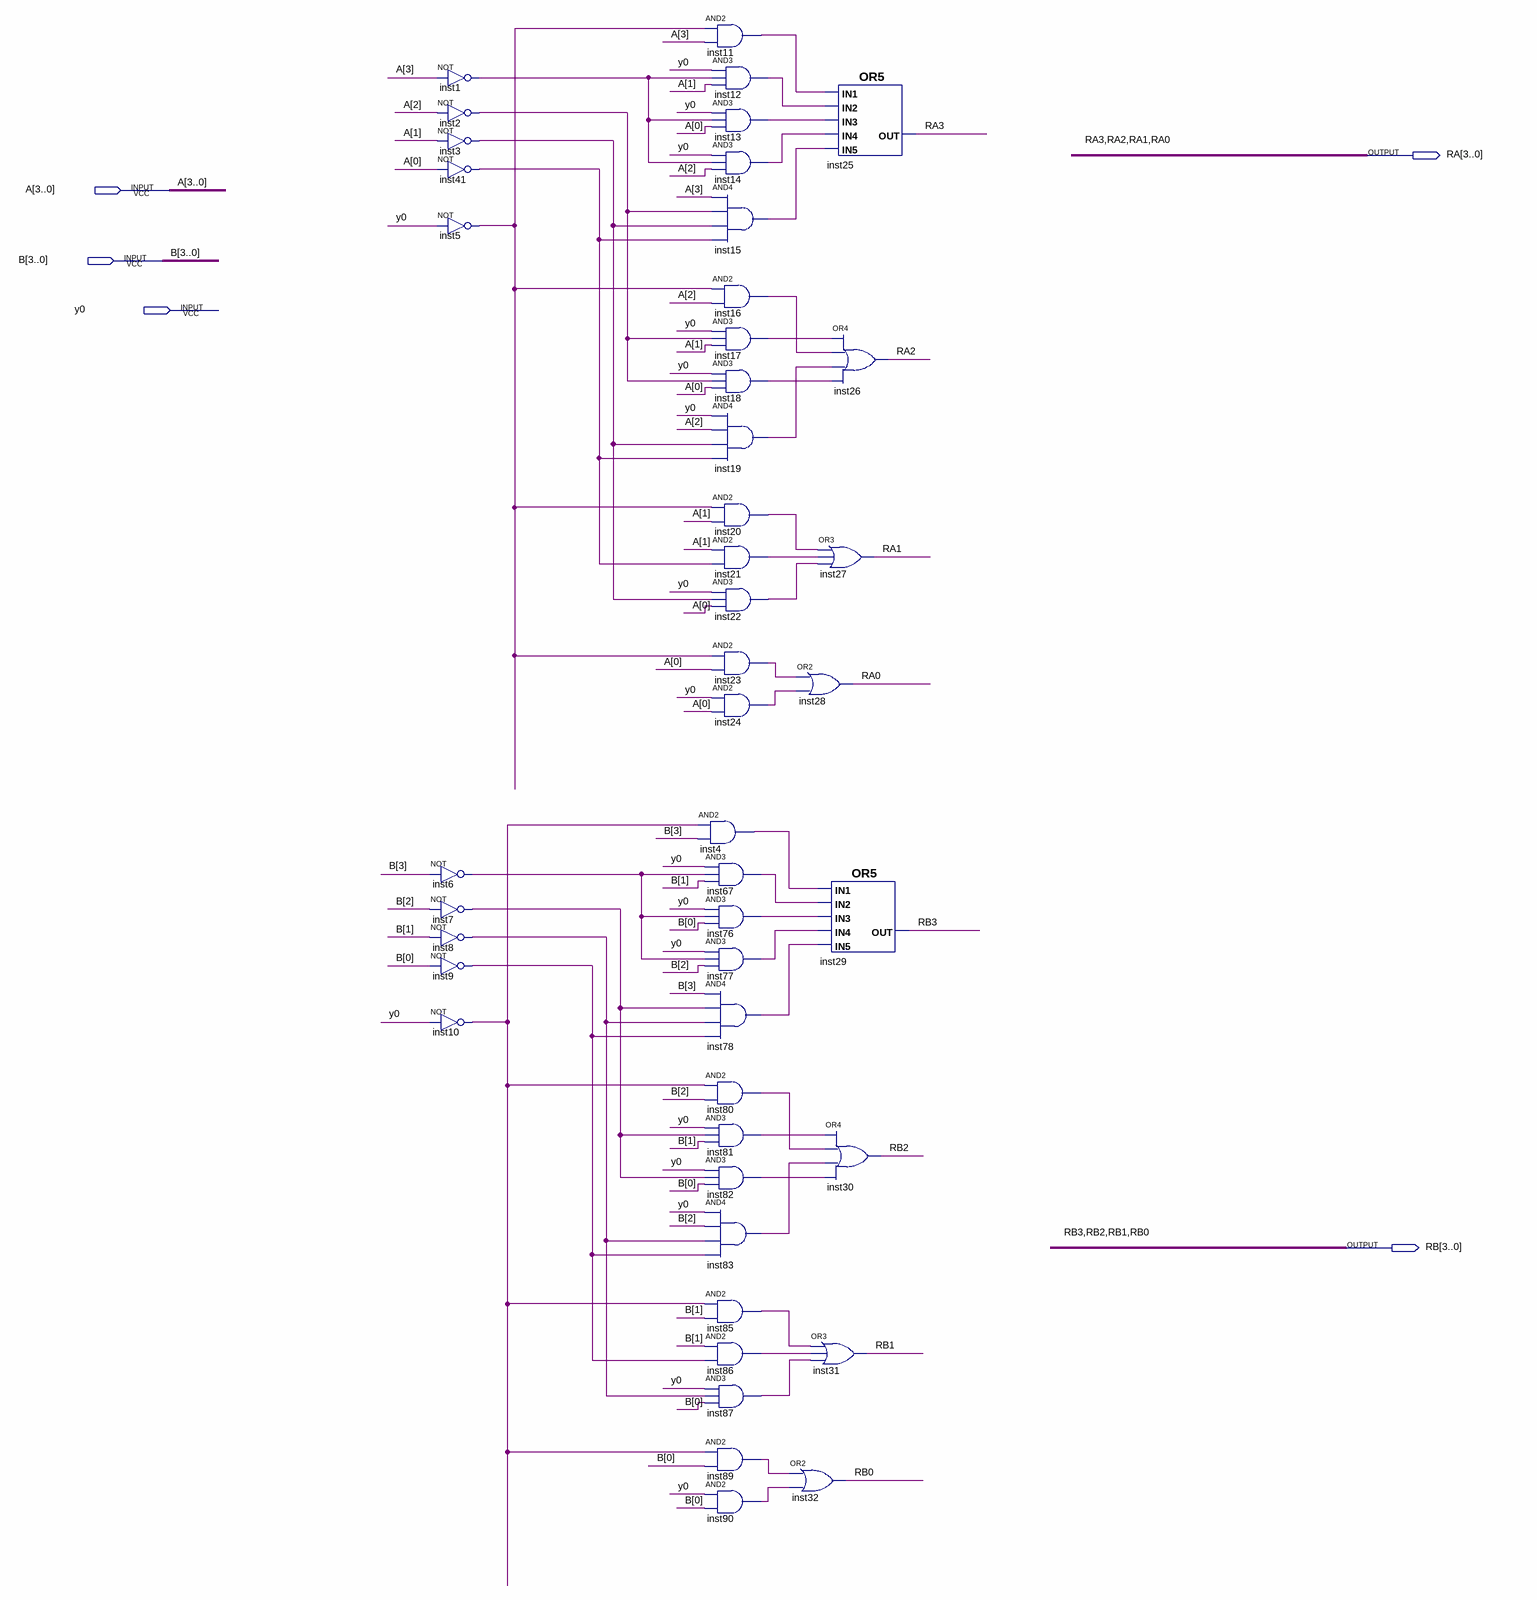
[diagram p0: schematic sheet]
// Quartus schematic KC0.bdf as structural Verilog: 46 symbols, 5 pins
module KC0 (
  input  [3:0] A,
  input  [3:0] B,
  input  y0,
  output [3:0] RA,
  output [3:0] RB
);

  wire inst1_out, inst2_out, inst3_out, inst4_out, inst5_out, inst6_out, inst7_out, inst8_out, inst9_out,
       inst10_out, inst11_out, inst12_out, inst13_out, inst14_out, inst15_out, inst16_out, inst17_out,
       inst18_out, inst19_out, inst20_out, inst21_out, inst22_out, inst23_out, inst24_out, inst41_out,
       inst67_out, inst76_out, inst77_out, inst78_out, inst80_out, inst81_out, inst82_out, inst83_out,
       inst85_out, inst86_out, inst87_out, inst89_out, inst90_out;

  not inst1 (inst1_out, A[3]);
  not inst2 (inst2_out, A[2]);
  not inst3 (inst3_out, A[1]);
  not inst41 (inst41_out, A[0]);
  not inst5 (inst5_out, y0);
  not inst6 (inst6_out, B[3]);
  not inst7 (inst7_out, B[2]);
  not inst8 (inst8_out, B[1]);
  not inst9 (inst9_out, B[0]);
  not inst10 (inst10_out, y0);
  and inst11 (inst11_out, inst5_out, A[3]);
  and inst12 (inst12_out, y0, inst1_out, A[1]);
  and inst13 (inst13_out, y0, inst1_out, A[0]);
  and inst14 (inst14_out, y0, inst1_out, A[2]);
  and inst15 (inst15_out, A[3], inst2_out, inst3_out, inst41_out);
  and inst16 (inst16_out, inst5_out, A[2]);
  and inst17 (inst17_out, y0, inst2_out, A[1]);
  and inst18 (inst18_out, y0, inst2_out, A[0]);
  and inst19 (inst19_out, y0, A[2], inst3_out, inst41_out);
  and inst20 (inst20_out, inst5_out, A[1]);
  and inst21 (inst21_out, A[1], inst41_out);
  and inst22 (inst22_out, y0, inst3_out, A[0]);
  and inst23 (inst23_out, inst5_out, A[0]);
  and inst24 (inst24_out, y0, A[0]);
  and inst4 (inst4_out, inst10_out, B[3]);
  and inst67 (inst67_out, y0, inst6_out, B[1]);
  and inst76 (inst76_out, y0, inst6_out, B[0]);
  and inst77 (inst77_out, y0, inst6_out, B[2]);
  and inst78 (inst78_out, B[3], inst7_out, inst8_out, inst9_out);
  and inst80 (inst80_out, inst10_out, B[2]);
  and inst81 (inst81_out, y0, inst7_out, B[1]);
  and inst82 (inst82_out, y0, inst7_out, B[0]);
  and inst83 (inst83_out, y0, B[2], inst8_out, inst9_out);
  and inst85 (inst85_out, inst10_out, B[1]);
  and inst86 (inst86_out, B[1], inst9_out);
  and inst87 (inst87_out, y0, inst8_out, B[0]);
  and inst89 (inst89_out, inst10_out, B[0]);
  and inst90 (inst90_out, y0, B[0]);
  or inst25 (RA[3], inst11_out, inst12_out, inst13_out, inst14_out, inst15_out);
  or inst26 (RA[2], inst17_out, inst16_out, inst19_out, inst18_out);
  or inst27 (RA[1], inst20_out, inst21_out, inst22_out);
  or inst28 (RA[0], inst23_out, inst24_out);
  or inst29 (RB[3], inst4_out, inst67_out, inst76_out, inst77_out, inst78_out);
  or inst30 (RB[2], inst81_out, inst80_out, inst83_out, inst82_out);
  or inst31 (RB[1], inst85_out, inst86_out, inst87_out);
  or inst32 (RB[0], inst89_out, inst90_out);
endmodule
